# EAGLE schematic dummyvideo (EAGLE 6.5.0)
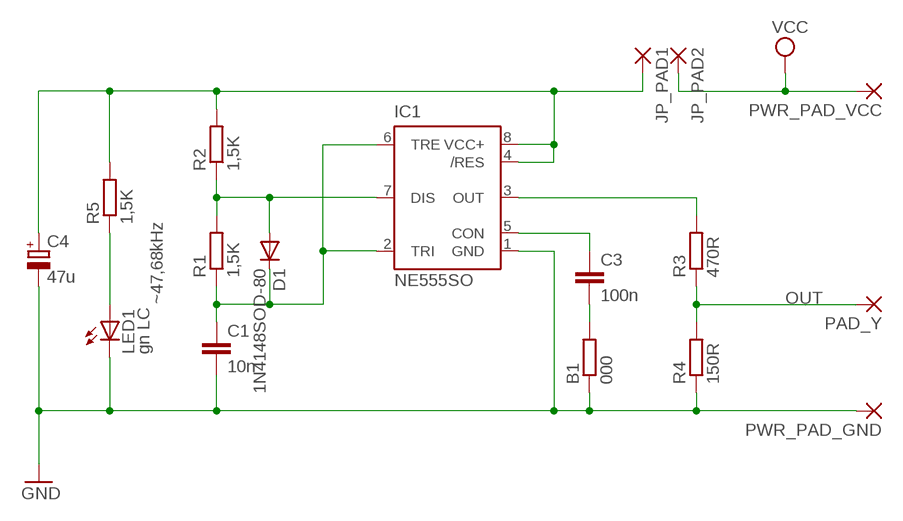
[diagram p0: schematic, sheet 1]

## Parts
B1  000  R-EU_R1206  [R1206]
C1  10n  C-EUC0805  [C0805]
C3  100n  C-EUC0805  [C0805]
C4  47u  CPOL-EU153CLV-0505  [153CLV-0505]
D1  1N4148SOD-80  [SOD80C]
IC1  NE555SO  [SO08]
JP_PAD1  SMD2  [SMD1,27-2,54]
JP_PAD2  SMD2  [SMD1,27-2,54]
LED1  gn LC  LEDCHIP-LED0603  [CHIP-LED0603]
PAD_Y  SMD2  [SMD1,27-2,54]
PWR_PAD_GND  SMD2  [SMD1,27-2,54]
PWR_PAD_VCC  SMD2  [SMD1,27-2,54]
R1  1,5K  R-EU_R0805  [R0805]
R2  1,5K  R-EU_M0805  [M0805]
R3  470R  R-EU_R0805  [R0805]
R4  150R  R-EU_R0805  [R0805]
R5  1,5K  R-EU_R0805  [R0805]

## Nets
GND: B1.1 B1.2 C1.2 C3.2 C4.- IC1.1(GND) LED1.C PWR_PAD_GND.1(P) R4.1
N$1: D1.A IC1.7(DIS) R1.2 R2.1
N$2: C3.1 IC1.5(CON)
N$3: C1.1 D1.C IC1.2(TRI) IC1.6(TRE) R1.1
N$4: IC1.3(OUT) R3.2
N$5: LED1.A R5.1
OUT: PAD_Y.1(P) R3.1 R4.2
VCC: JP_PAD2.1(P) PWR_PAD_VCC.1(P)
VCC_SW: C4.+ IC1.4(/RES) IC1.8(VCC+) JP_PAD1.1(P) R2.2 R5.2

## Notes on the sheet
- ~47,68kHz

## Library data of the parts
B1 R1-R5 = resistor:R-EU_: RESISTOR, European symbol
C1 C3 = resistor:C-EU: CAPACITOR, European symbol
C4 = resistor:CPOL-EU: POLARIZED CAPACITOR, European symbol
D1 = n39:1N4148: DIODE high speed (Philips) Copied from diode.lbr
IC1 = n39:NE555: General purpose bipolar Timer Copied from st-microelectronics.lbr; MPN: NE555D; OC_REICHELT: NE 555 D SMD
JP_PAD1 JP_PAD2 PAD_Y PWR_PAD_GND PWR_PAD_VCC = wirepad:SMD2: SMD PAD
LED1 = led:LED: LED OSRAM: - CHIPLED LG R971, LG N971, LY N971, LG Q971, LY Q971, LO R971, LY R971 LH N974, LH R974 LS Q976, LO Q976, LY Q976 LO Q996 - Hyper CHIPLED LW Q18S LB Q993, LB Q99A, LB R99A - SideLED LS A670, LO A670, LY A670, LG A670, LP A670 LB A673, LV A673, LT A673, LW A673 LH A674 LY A675 LS A676, LA A676, LO A676, LY A676, LW A676 LS A679, LY A679, LG A679 - Hyper Micro SIDELED® LS Y876, LA Y876, LO Y876, LY Y876 LT Y87S - SmartLED LW L88C, LW L88S LB L89C, LB L89S, LG L890 LS L89K, LO L89K, LY L89K LS L896, LA L896, LO L896, LY L896 - TOPLED LS T670, LO T670, LY T670, LG T670, LP T670 LSG T670, LSP T670, LSY T670, LOP T670, LYG T670 LG T671, LOG T671, LSG T671 LB T673, LV T673, LT T673, LW T673 LH T674 LS T676, LA T676, LO T676, LY T676, LB T676, LH T676, LSB T676, LW T676 LB T67C, LV T67C, LT T67C, LS T67K, LO T67K, LY T67K, LW E67C LS E67B, LA E67B, LO E67B, LY E67B, LB E67C, LV E67C, LT E67C LW T67C LS T679, LY T679, LG T679 LS T770, LO T770, LY T770, LG T770, LP T770 LB T773, LV T773, LT T773, LW T773 LH T774 LS E675, LA E675, LY E675, LS T675 LS T776, LA T776, LO T776, LY T776, LB T776 LHGB T686 LT T68C, LB T68C - Hyper Mini TOPLED® LB M676 - Mini TOPLED Santana® LG M470 LS M47K, LO M47K, LY M47K Source: http://www.osram.convergy.de LUXEON: - LUMILED® LXK2-PW12-R00, LXK2-PW12-S00, LXK2-PW14-U00, LXK2-PW14-V00 LXK2-PM12-R00, LXK2-PM12-S00, LXK2-PM14-U00 LXK2-PE12-Q00, LXK2-PE12-R00, LXK2-PE12-S00, LXK2-PE14-T00, LXK2-PE14-U00 LXK2-PB12-K00, LXK2-PB12-L00, LXK2-PB12-M00, LXK2-PB14-N00, LXK2-PB14-P00, LXK2-PB14-Q00 LXK2-PR12-L00, LXK2-PR12-M00, LXK2-PR14-Q00, LXK2-PR14-R00 LXK2-PD12-Q00, LXK2-PD12-R00, LXK2-PD12-S00 LXK2-PH12-R00, LXK2-PH12-S00 LXK2-PL12-P00, LXK2-PL12-Q00, LXK2-PL12-R00 Source: www.luxeon.com KINGBRIGHT: KA-3528ASYC Source: www.kingbright.com